# Altium schematic sheet Sheet1.SchDoc
size A4
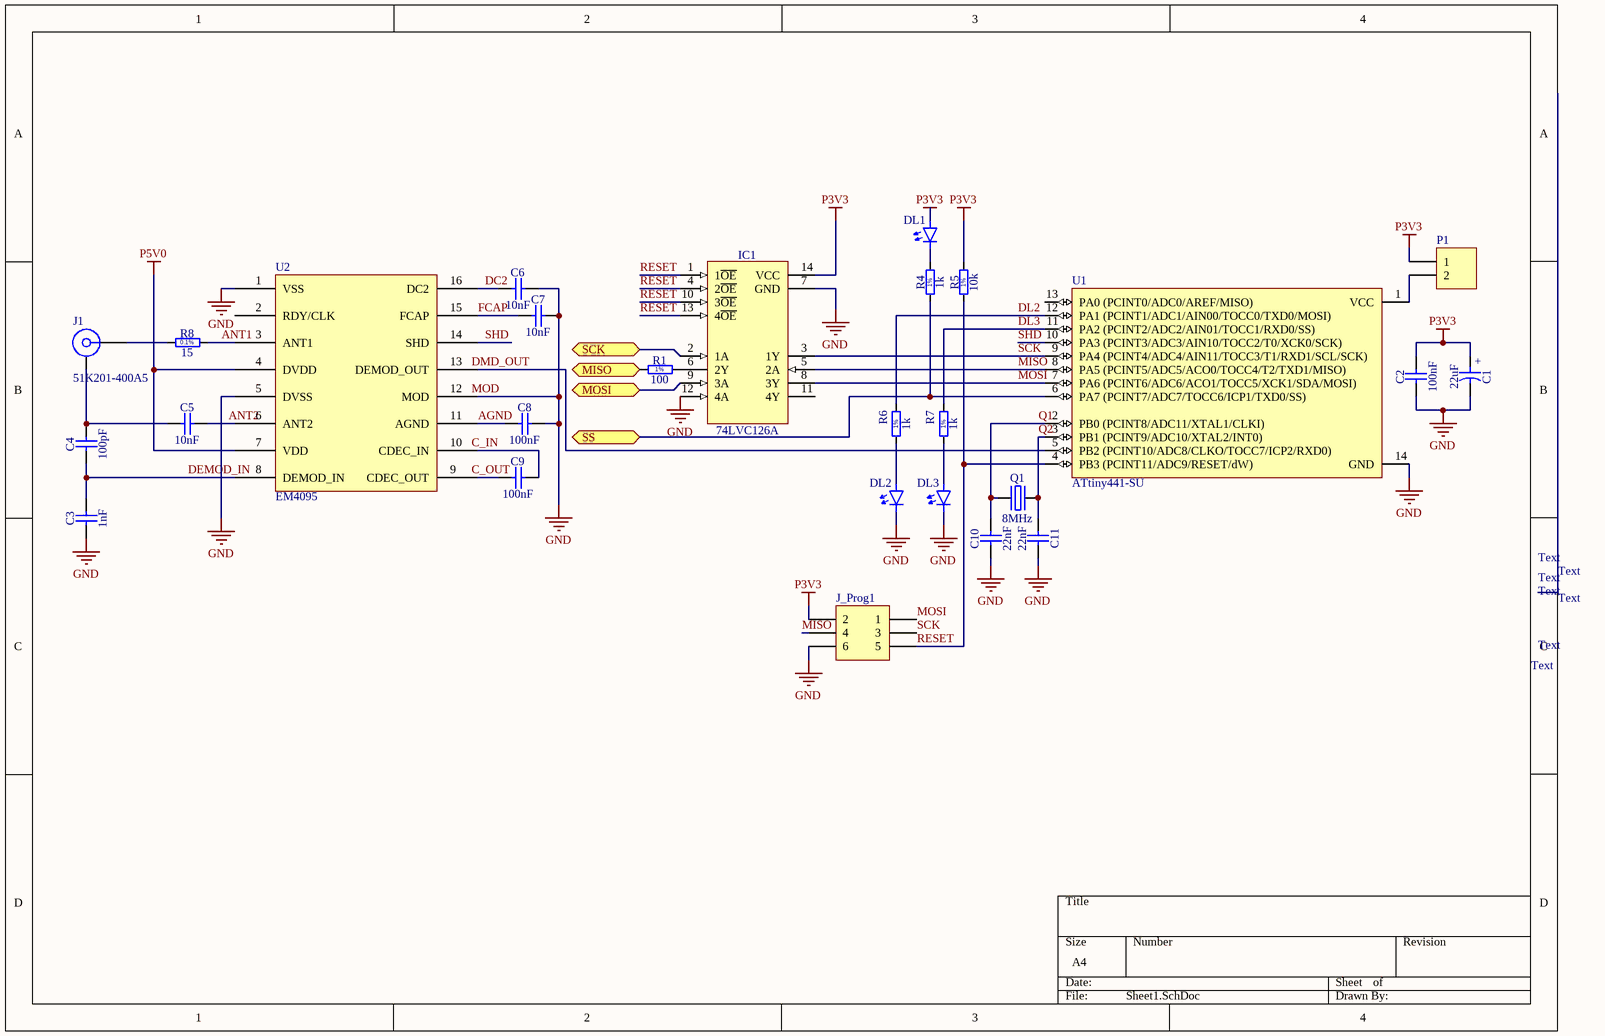
[diagram p0: Sheet1.SchDoc]

## Parts
C1  22uF  [CAPAE430X540N]
C2  100nF  [CAPC1608X90N]
C3  1nF  [CAPC1608X87N]
C4  100pF  [CAPC1608X90N]
C5  10nF  [CAPC1608X87N]
C6  10nF  [CAPC1608X87N]
C7  10nF  [CAPC1608X87N]
C8  100nF  [CAPC1608X87N]
C9  100nF  [CAPC1608X87N]
C10  22nF  [CAPC0603X33N]
C11  22nF  [CAPC0603X33N]
DL1  (no value)  [0805_LED]
DL2  (no value)  [0805_LED]
DL3  (no value)  [0805_LED]
IC1  74LVC126A  [SOIC127P600X175-14N]
J1  51K201-400A5  [ROS-51K201-400A5_V]
J_Prog1  (no value)  [HDR2X3]
P1  (no value)  [HDR1X2]
Q1  8MHz  [XTAL_TXC_7A]
R1  100  [RESC1608X50N]
R4  1k  [RESC1608X50N]
R5  10k  [RESC1608X50N]
R6  1k  [RESC1608X50N]
R7  1k  [RESC1608X50N]
R8  15  [RESC1608X50N]
U1  (no value)  [14S1_L]
U2  EM4095  [SO16_N]

## Ports
MISO (bidir), MOSI (bidir), SCK (bidir), SS (bidir)

## Nets
GND: C1.2 C2.1 C3.1 C6.2 C7.2 C8.2 C10.1 C11.2 DL2.K DL3.K IC1.7(GND) IC1.12(4A) J_Prog1.6 U1.14(GND) U2.1(VSS) U2.5(DVSS) U2.12(MOD)
P3V3: C1.1 C2.2 DL1.A IC1.14(VCC) J_Prog1.2 P1.1 R5.2
P5V0: U2.4(DVDD) U2.7(VDD)
AGND: C8.1 U2.11(AGND)
ANT1: R8.2 U2.3(ANT1)
ANT2: C5.2 U2.6(ANT2)
DC2: C6.1 U2.16(DC2)
DEMOD_IN: C3.2 C4.1 U2.8(DEMOD_IN)
DL2: R6.2 U1.12(PA1_(PCINT1/ADC1/AIN00/TOCC0/TXD0/MOSI))
DL3: R7.2 U1.11(PA2_(PCINT2/ADC2/AIN01/TOCC1/RXD0/SS))
FCAP: C7.1 U2.15(FCAP)
MISO: IC1.5(2A) J_Prog1.4 U1.8(PA5_(PCINT5/ADC5/ACO0/TOCC4/T2/TXD1/MISO))
MISO: R1.1 ; port MISO  [a separate net that carries the same name]
MOSI: IC1.8(3Y) J_Prog1.1 U1.7(PA6_(PCINT6/ADC6/ACO1/TOCC5/XCK1/SDA/MOSI))
MOSI: IC1.9(3A) ; port MOSI  [a separate net that carries the same name]
Q1: C10.2 Q1.1(OSC1) U1.2(PB0_(PCINT8/ADC11/XTAL1/CLKI))
Q2: C11.1 Q1.2(OSC2) U1.3(PB1_(PCINT9/ADC10/XTAL2/INT0))
RESET: IC1.1(1~{OE}) IC1.4(2~{OE}) IC1.10(3~{OE}) IC1.13(4~{OE}) J_Prog1.5 R5.1 U1.4(PB3_(PCINT11/ADC9/RESET/dW))
SCK: IC1.3(1Y) J_Prog1.3 U1.9(PA4_(PCINT4/ADC4/AIN11/TOCC3/T1/RXD1/SCL/SCK))
SCK: IC1.2(1A) ; port SCK  [a separate net that carries the same name]
SHD: U1.10(PA3_(PCINT3/ADC3/AIN10/TOCC2/T0/XCK0/SCK)) U2.14(SHD)
SS: R4.1 U1.6(PA7_(PCINT7/ADC7/TOCC6/ICP1/TXD0/SS)) ; port SS
NetC4_2: C4.2 C5.1 J1.MH
NetC9_1: C9.1 U2.9(CDEC_OUT)
NetC9_2: C9.2 U2.10(CDEC_IN)
NetDL1_K: DL1.K R4.2
NetDL2_A: DL2.A R6.1
NetDL3_A: DL3.A R7.1
NetIC1_6: IC1.6(2Y) R1.2
NetJ1_1: J1.1 R8.1
NetP1_2: P1.2 U1.1(VCC)
NetU1_5: U1.5(PB2_(PCINT10/ADC8/CLKO/TOCC7/ICP2/RXD0)) U2.13(DEMOD_OUT)

Not connected (* = marked no-connect by the designer): IC1 11(4Y); U1 13(PA0_(PCINT0/ADC0/AREF/MISO)); U2 2(RDY/CLK)

## Notes on the sheet
- Text
- Labels drawn without touching a wire or pin: C_IN, C_OUT, DMD_OUT, MOD
- (in symbol CAE430-540_22UF_10V_20%) +
- (in symbol R0603_15R_0.1%_0.063W_10PPM) 0.1%
- (in symbol R0603_100R_1%_0.1W_100PPM) 1%
- (in symbol R0805_1K_1%_0.33W_100PPM_VISHAY_CRCW-HP) 1%

## Library data of the parts
C1 = CAE430-540_22UF_10V_20%: Polarised capacitor; Part Description: Aluminum Electrolytic SMT Capacitor; Manufacturer: PANASONIC; Manufacturer Part Number: EEEFK1A220AR; Voltage: 10V; Tolerance: ±20%; Part Number: CAE430-540_22UF_10V_20%; Component Kind: Standard; Component Type: Standard; Pin Count: 2; Value: 22uF; Status: Not Recommended; Case: B; Mounted: Yes; Socket: No; SMD: Yes; Sense: No; ComponentHeight: 5.8mm; HelpURL: \\cern.ch\dfs\Applications\Altium\Datasheets\CAE_PANASONIC_FK.pdf; Author: CERN DEM JLC; CreateDate: 2007-12-03; LatestRevisionDate: 2014-11-05
C2 = CC0603_100NF_100V_10%_X7R: Non-polarised capacitor; Part Description: SMD Multilayer Chip Ceramic Capacitor; Manufacturer: GENERIC; Manufacturer1 Part Number: GRM188R72A104KA35D; Voltage: 100V; TC: X7R; Tolerance: ±10%; Part Number: CC0603_100NF_100V_10%_X7R; Component Kind: Standard; Component Type: Standard; Pin Count: 2; Value: 100nF; Status: None; Manufacturer Part Number: CC0603_100NF_100V_10%_X7R; Case: 0603; Mounted: Yes; Socket: No; SMD: Yes; Sense: No; Manufacturer1 Example: MURATA; Manufacturer1 ComponentHeight: 0.9mm; HelpURL: \\cern.ch\dfs\Applications\Altium\Datasheets\CC0603_MURATA_GRM188R72A104KA35D.pdf; Author: CERN DEM JLC; CreateDate: 2013-12-11; LatestRevisionDate: 2013-12-11
C3 = CC0603_1NF_100V_10%_X7R: Non-polarised capacitor; Part Description: SMD Multilayer Chip Ceramic Capacitor; Manufacturer: GENERIC; Manufacturer1 Part Number: C0603C102K1RACTU; Voltage: 100V; TC: X7R; Tolerance: ±10%; Part Number: CC0603_1NF_100V_10%_X7R; Component Kind: Standard; Component Type: Standard; Pin Count: 2; Value: 1nF; Status: Preferred; Manufacturer Part Number: CC0603_1NF_100V_10%_X7R; Case: 0603; Mounted: Yes; Socket: No; SMD: Yes; Sense: No; Manufacturer1 Example: KEMET; Manufacturer1 ComponentHeight: 0.87mm; HelpURL: \\cern.ch\dfs\Applications\Altium\Datasheets\CC0603_X7R_KEMET.pdf; Author: CERN DEM JLC; CreateDate: 2013-12-12; LatestRevisionDate: 2013-12-12
C4 = CC0603_100PF_250V_5%_ATC_600S: Non-polarised capacitor; Part Description: Ultra-Low ESR, High Q, NPO RF & Microwave Capacitor; Manufacturer: AMERICAN TECHNICAL CERAMICS (ATC); Manufacturer Part Number: 600S101JT250XT; Voltage: 250V; TC: C0G/NP0; Tolerance: ±5%; Part Number: CC0603_100PF_250V_5%_ATC_600S; Component Kind: Standard; Component Type: Standard; Pin Count: 2; Value: 100pF; Status: Not Recommended; Case: 0603; Mounted: Yes; Socket: No; SMD: Yes; Sense: No; ComponentHeight: 0.89mm; HelpURL: \\cern.ch\dfs\Applications\Altium\Datasheets\CC0603_ATC_600S.pdf; Author: CERN DEM JMW; CreateDate: 2016-08-11; LatestRevisionDate: 2016-08-11
C5-C7 = CC0603_10NF_50V_10%_X7R: Non-polarised capacitor; Part Description: SMD Multilayer Chip Ceramic Capacitor; Manufacturer: GENERIC; Manufacturer1 Part Number: 223858615636; Voltage: 50V; TC: X7R; Tolerance: ±10%; Part Number: CC0603_10NF_50V_10%_X7R; Component Kind: Standard; Component Type: Standard; Pin Count: 2; Value: 10nF; Status: Preferred; Manufacturer Part Number: CC0603_10NF_50V_10%_X7R; Case: 0603; Mounted: Yes; Socket: No; SMD: Yes; Sense: No; Manufacturer1 Example: PHYCOMP; Manufacturer1 ComponentHeight: 0.87mm; HelpURL: \\cern.ch\dfs\Applications\Altium\Datasheets\CC0603_X7R_PHYCOMP.pdf; Author: CERN DEM JLC; CreateDate: 2007-12-03; LatestRevisionDate: 2007-12-03
C8 C9 = CC0603_10NF_50V_10%_X7R: Non-polarised capacitor; Part Description: SMD Multilayer Chip Ceramic Capacitor; Manufacturer: GENERIC; Manufacturer1 Part Number: 223858615636; Value: 10nF; Voltage: 50V; TC: X7R; Tolerance: ±10%; Part Number: CC0603_10NF_50V_10%_X7R; Component Kind: Standard; Component Type: Standard; Pin Count: 2; Status: Preferred; Manufacturer Part Number: CC0603_10NF_50V_10%_X7R; Case: 0603; Mounted: Yes; Socket: No; SMD: Yes; Sense: No; Manufacturer1 Example: PHYCOMP; Manufacturer1 ComponentHeight: 0.87mm; HelpURL: \\cern.ch\dfs\Applications\Altium\Datasheets\CC0603_X7R_PHYCOMP.pdf; Author: CERN DEM JLC; CreateDate: 2007-12-03; LatestRevisionDate: 2007-12-03
C10 C11 = CC0201_22NF_6.3V_10%_X5R: Non-polarised capacitor; Part Description: SMD Multilayer Chip Ceramic Capacitor; Manufacturer: GENERIC; Manufacturer1 Part Number: 02016D223KAT2A; Voltage: 6.3V; TC: X5R; Tolerance: ±10%; Part Number: CC0201_22NF_6.3V_10%_X5R; Component Kind: Standard; Component Type: Standard; Pin Count: 2; Value: 22nF; Status: Not Recommended; Manufacturer Part Number: CC0201_22NF_6.3V_10%_X5R; Case: 0201; Mounted: Yes; Socket: No; SMD: Yes; Sense: No; Manufacturer1 Example: AVX; Manufacturer1 ComponentHeight: 0.33mm; HelpURL: \\cern.ch\dfs\Applications\Altium\Datasheets\CC0201_X5R_AVX.pdf; Author: CERN DEM JLC; CreateDate: 2007-12-03; LatestRevisionDate: 2007-12-03
DL1-DL3 = LED1: Light Emitting Diode
IC1 = 74125: Quadruple Bus Buffer with 3-State Outputs; Part Number: SN74HC125D; Manufacturer: TEXAS INSTRUMENTS; PressFit: No; Bonding: No; Component Kind: Standard; Component Type: Standard; Device: SN74HC125D; PackageDescription: SOIC 14, Pitch 1.27mm - Body 4x8.75mm, IPC Medium Density; Part Description: Quadruple Bus Buffer with 3-State Outputs; Manufacturer Part Number: SN74HC125D; Pin Count: 14; Case: SOIC14; Mounted: Yes; Socket: No; SMD: Yes; Sense: No; ComponentHeight: 1.75mm; Author: CERN DEM JLC; HelpURL: \\cern.ch\dfs\Applications\Altium\Datasheets\SN74HC125D.pdf; CreateDate: 2011-06-30; LatestRevisionDate: 2011-06-30
J1 = 51K201-400A5: BNC 50R Right Angle Jack, Up to 10 GHz, -55 to 155 degC; Design Note: Footprint in library is a generic example - only application specific footprint delivers High Performance; DatasheetVersion: a00; PackageVersion: a00; PackageReference: 51K201-400A5; PackageDescription: 50R BNC Right Angle Jack, 12 x 23.1 x 14.5 mm; Mounting Technology: Through Hole; PartNumber: 51K201-400A5; ComponentLink1Description: Manufacturer URL; ComponentLink1URL: http://www.rosenberger.de; ComponentLink2Description: Datasheet; ComponentLink2URL: http://rosenberger.de/ok/images/documents/db/51K201-400A5.pdf; ComponentLink3Description: Package Specification; ComponentLink3URL: http://rosenberger.de/ok/images/documents/db/51K201-400A5.pdf; ComponentLink4Description: Series Overview / Design Note; ComponentLink4URL: http://rosenberger.de/ok/images/documents/spez/51.pdf; ComponentLink5Description: Webshop / RFQ; ComponentLink5URL: http://www.rosenberger.com/en/contact/sales/
J_Prog1 = Header 3X2: Header, 3-Pin, Dual row; LatestRevisionDate: 17-Jul-2002; LatestRevisionNote: Re-released for DXP Platform.; Publisher: Altium Limited
P1 = Header 2: Header, 2-Pin; LatestRevisionDate: 17-Jul-2002; LatestRevisionNote: Re-released for DXP Platform.; Publisher: Altium Limited
Q1 = XTAL_8MHZ_TXC_7A-8.000MAAE-T: Quartz Crystal; Part Description: Tolerance: ±30ppm, Stability: ±30ppm, -20°C to +70°C, 12pF, SMD Glass Seam Sealing Crystal, 7A Series; Manufacturer: TXC CORPORATION; PressFit: No; Bonding: No; Part Number: XTAL_8MHZ_TXC_7A-8.000MAAE-T; Component Kind: Standard; Component Type: Standard; PackageDescription: 2 Pins, 3.2x5mm, SMD Glass Seam Sealing Crystal, 7A Serie; Value: 8MHz; Manufacturer Part Number: 7A-8.000MAAE-T; Pin Count: 2; Mounted: Yes; Socket: No; SMD: Yes; Sense: No; ComponentHeight: 1.2mm; HelpURL: \\cern.ch\dfs\Applications\Altium\Datasheets\XTAL_TXC_7A.pdf; Author: CERN DEM JLC; CreateDate: 2014-10-09; LatestRevisionDate: 2014-11-12
R1 = R0603_100R_1%_0.1W_100PPM: Resistor - 1%; Part Description: General Purpose Thick Film Chip Resistor; Manufacturer: GENERIC; Manufacturer1 Part Number: NRC06F4700TRF; Power: 0.1W; TC: ±100ppm/°C; PressFit: No; Part Number: R0603_100R_1%_0.1W_100PPM; Component Kind: Standard; Component Type: Standard; Footprint: RESC1608X55N; Pin Count: 2; Value: 100; Status: Preferred; Tolerance: ±1%; Manufacturer Part Number: R0603_100R_1%_0.1W_100PPM; Case: 0603; Mounted: Yes; Sense: No; Socket: No; SMD: Yes; Manufacturer1 Example: NIC COMPONENT; Manufacturer1 ComponentHeight: 0.55mm; HelpURL: \\cern.ch\dfs\Applications\Altium\Datasheets\R0603_NIC_NRC.pdf; Author: CERN DEM JLC; CreateDate: 2007-12-03; LatestRevisionDate: 2008-03-13
R4 R6 R7 = R0805_1K_1%_0.33W_100PPM_VISHAY_CRCW-HP: Resistor - 1%; Part Description: 150V, Pulse Proof, High Power Thick Film Chip Resistor; Manufacturer: VISHAY DRALORIC; Manufacturer Part Number: CRCW08051K00FKEAHP; Power: 0.33W; TC: ±100ppm/°C; PressFit: No; Part Number: R0805_1K_1%_0.33W_100PPM_VISHAY_CRCW-HP; Component Kind: Standard; Component Type: Standard; Footprint: RESC2012X60N; Pin Count: 2; Value: 1k; Status: None; Tolerance: ±1%; Case: 0805; Mounted: Yes; Sense: No; Socket: No; SMD: Yes; Manufacturer1 ComponentHeight: 0.6mm; HelpURL: \\cern.ch\dfs\Applications\Altium\Datasheets\R0805_VISHAY_CRCW-HP e3.pdf; Author: CERN DEM JLC; CreateDate: 2010-06-16; LatestRevisionDate: 2010-06-16
R5 = R0805_1K_1%_0.33W_100PPM_VISHAY_CRCW-HP: Resistor - 1%; Part Description: 150V, Pulse Proof, High Power Thick Film Chip Resistor; Manufacturer: VISHAY DRALORIC; Manufacturer Part Number: CRCW08051K00FKEAHP; Value: 1k; Power: 0.33W; TC: ±100ppm/°C; PressFit: No; Part Number: R0805_1K_1%_0.33W_100PPM_VISHAY_CRCW-HP; Component Kind: Standard; Component Type: Standard; Footprint: RESC2012X60N; Pin Count: 2; Status: None; Tolerance: ±1%; Case: 0805; Mounted: Yes; Sense: No; Socket: No; SMD: Yes; Manufacturer1 ComponentHeight: 0.6mm; HelpURL: \\cern.ch\dfs\Applications\Altium\Datasheets\R0805_VISHAY_CRCW-HP e3.pdf; Author: CERN DEM JLC; CreateDate: 2010-06-16; LatestRevisionDate: 2010-06-16
R8 = R0603_15R_0.1%_0.063W_10PPM: Resistor - 0.1%; Part Description: Thin Film Chip Resistor; Manufacturer: GENERIC; Manufacturer1 Part Number: RN73C1J15RBTDF; Power: 0.063W; TC: ±10ppm; PressFit: No; Part Number: R0603_15R_0.1%_0.063W_10PPM; Component Kind: Standard; Component Type: Standard; Footprint: RESC1608X55N; Pin Count: 2; Value: 15; Status: Not Recommended; Tolerance: ±0.1%; Manufacturer Part Number: R0603_15R_0.1%_0.063W_10PPM; Case: 0603; Mounted: Yes; Sense: No; Socket: No; SMD: Yes; Manufacturer1 Example: TYCO HOLSWORTHY; Manufacturer1 ComponentHeight: 0.5mm; HelpURL: \\cern.ch\dfs\Applications\Altium\Datasheets\R0603_Tyco_RN73.pdf; Author: CERN DEM JLC; CreateDate: 2007-12-03; LatestRevisionDate: 2008-03-13
U1 = ATtiny441-SU: 8-bit AVR Microcontroller, 1.8-5.5V, 2KB Flash, 128 Bytes SRAM, 12 GPIO pins, 14-pin SOIC, Industrial Grade (-40°C to 85°C), Pb-Free; Published: 1-Apr-2010; DatasheetVersion: revA, Mar-2010; PackageVersion: revA, Feb-2002; PackageReference: 14S1; Publisher: Altium Limited; PackageDescription: 14-Lead, 0.150” Wide Body, Plastic Gull Wing Small Outline Package (SOIC); Code_JEDEC: MS-012-AB; Code_IPC: SOIC127P600-14; ComponentLink1Description: ATtiny20 Datasheet; ComponentLink1URL: http://www.atmel.com/dyn/resources/prod_documents/doc8235.pdf; ComponentLink2Description: ATtiny20 Summary; ComponentLink2URL: http://www.atmel.com/dyn/resources/prod_documents/8235S.pdf; ComponentLink3Description: Atmel.com Home; ComponentLink3URL: http://www.atmel.com; Supplier 1: Digi-Key; Supplier Part Number 1: 1611-ATTINY44-15SSZCT-ND; Name: ATtiny441-SU